# EAGLE design 8stepsV2 (EAGLE 7.4.0)
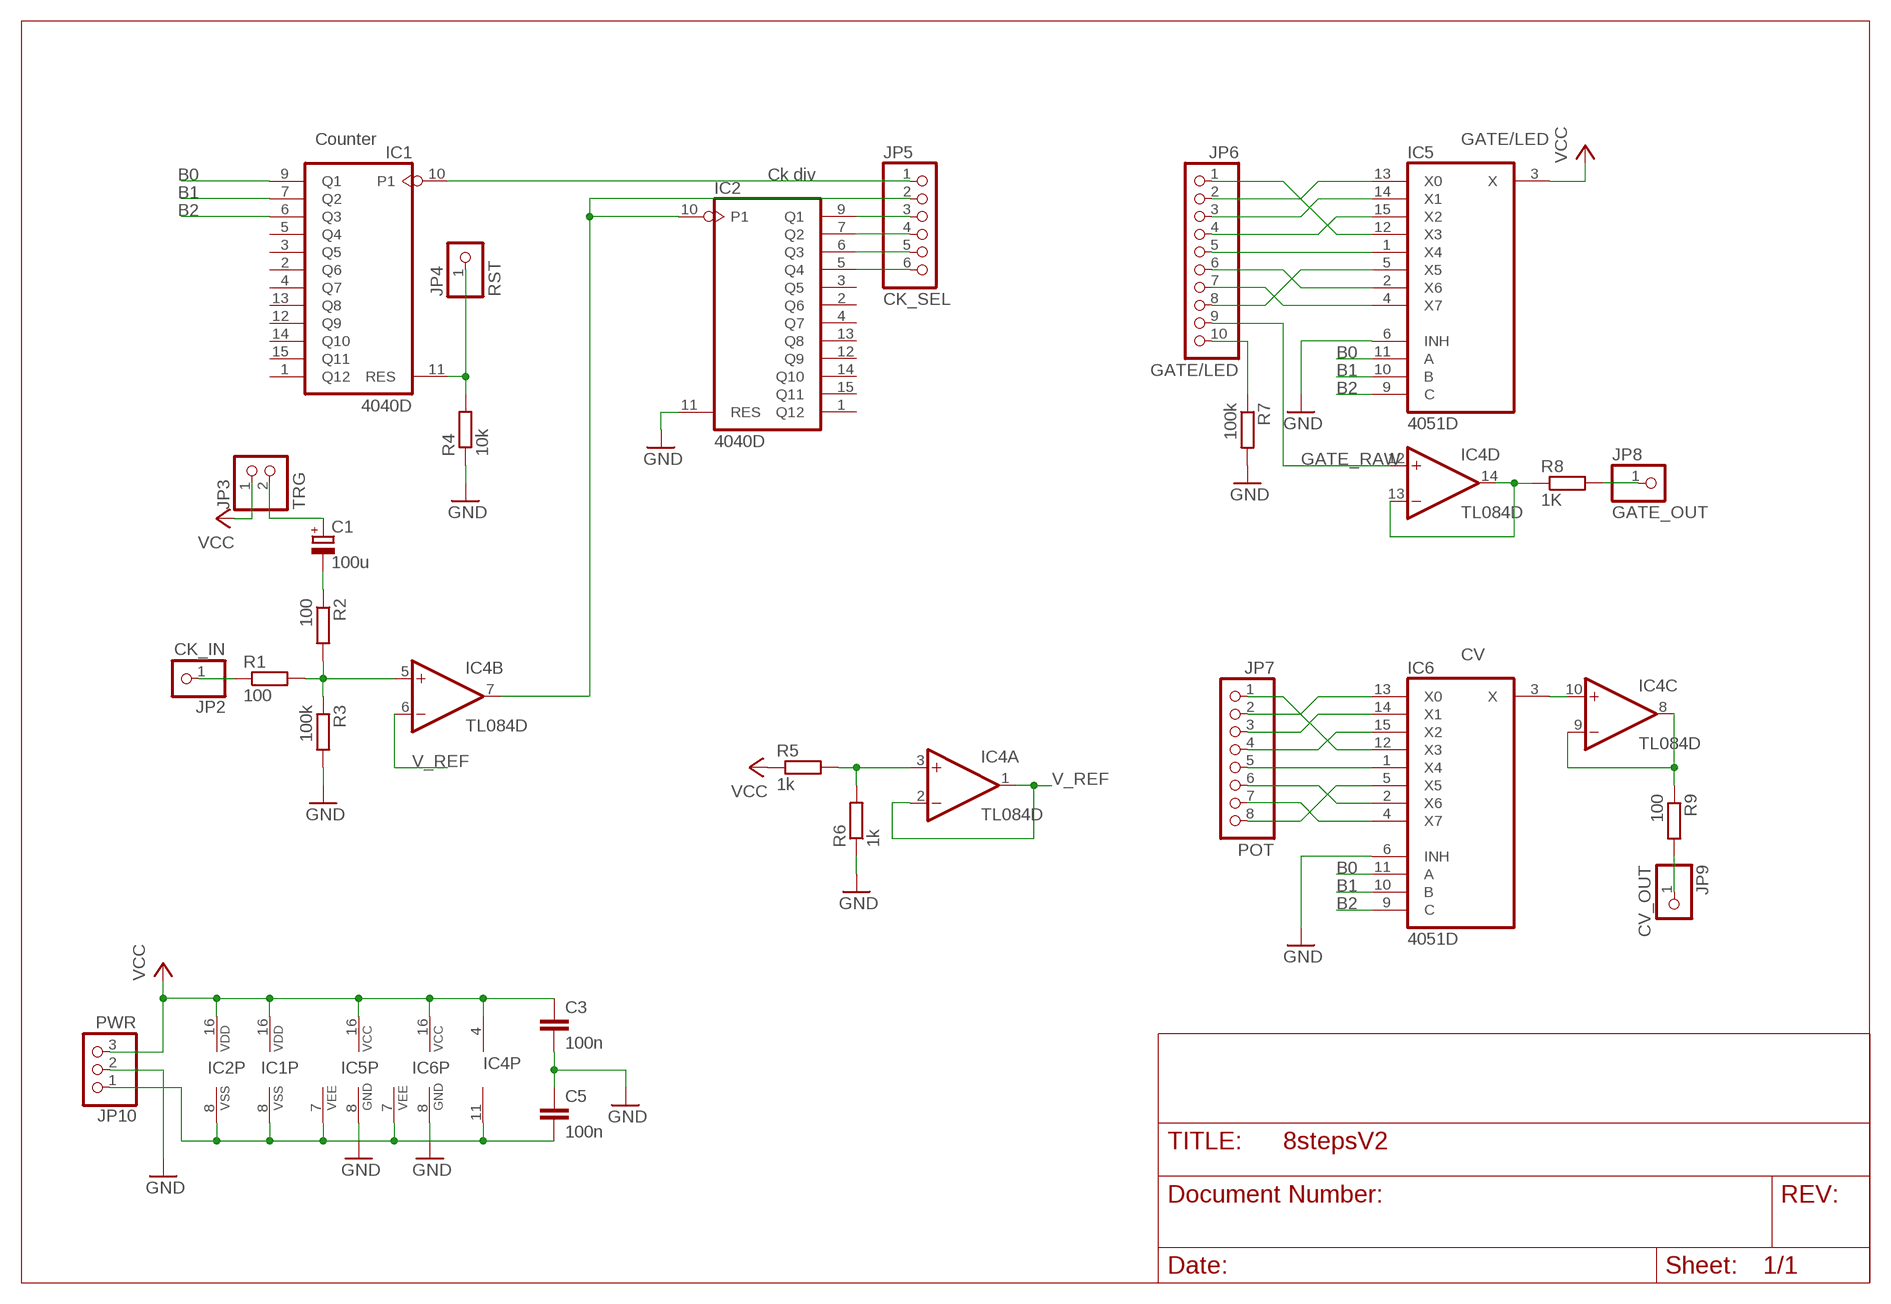
[diagram p0: schematic, sheet 1]

## Parts
C1  100u  CPOL-EUE2.5-7  [E2,5-7]
C3  100n  C-EU025-024X044  [C025-024X044]
C5  100n  C-EU025-024X044  [C025-024X044]
IC1  4040D  [SO16]
IC2  4040D  [SO16]
IC4  TL084D  [SO14]
IC5  4051D  [SO16]
IC6  4051D  [SO16]
JP2  CK_IN  PINHD-1X1  [1X01]
JP3  TRG  PINHD-1X2  [1X02]
JP4  RST  PINHD-1X1  [1X01]
JP5  CK_SEL  PINHD-1X6  [1X06]
JP6  GATE/LED  PINHD-1X10  [1X10]
JP7  POT  PINHD-1X8  [1X08]
JP8  GATE_OUT  PINHD-1X1  [1X01]
JP9  CV_OUT  PINHD-1X1  [1X01]
JP10  PWR  PINHD-1X3  [1X03]
R1  100  R-EU_R0805  [R0805]
R2  100  R-EU_R0805  [R0805]
R3  100k  R-EU_R0805  [R0805]
R4  10k  R-EU_R0805  [R0805]
R5  1k  R-EU_R0805  [R0805]
R6  1k  R-EU_R0805  [R0805]
R7  100k  R-EU_R0805  [R0805]
R8  1K  R-EU_R0805  [R0805]
R9  100  R-EU_R0805  [R0805]

## Nets
B0: IC1.9(Q1) IC5.11(A) IC6.11(A)
B1: IC1.7(Q2) IC5.10(B) IC6.10(B)
B2: IC1.6(Q3) IC5.9(C) IC6.9(C)
GATE_RAW: IC4.12(D:+IN) JP6.9
GND: C3.2 C5.1 IC2.11(RES) IC5.6(INH) IC5.8(GND) IC6.6(INH) IC6.8(GND) JP10.2 R3.2 R4.1 R6.1 R7.2
N$1: IC4.3(A:+IN) R5.2 R6.2
N$2: C1.- R2.1
N$3: IC4.10(C:+IN) IC6.3(X)
N$4: IC2.10(P1) IC4.7(B:OUT) JP5.2
N$5: IC2.9(Q1) JP5.3
N$6: IC2.7(Q2) JP5.4
N$7: IC2.6(Q3) JP5.5
N$8: IC2.5(Q4) JP5.6
N$9: IC1.10(P1) JP5.1
N$10: IC5.12(X3) JP6.1
N$11: IC5.13(X0) JP6.2
N$12: IC5.14(X1) JP6.3
N$13: IC5.15(X2) JP6.4
N$14: IC5.1(X4) JP6.5
N$15: IC5.4(X7) JP6.7
N$16: IC5.2(X6) JP6.6
N$17: IC5.5(X5) JP6.8
N$18: IC6.12(X3) JP7.1
N$19: IC6.13(X0) JP7.2
N$20: IC6.14(X1) JP7.3
N$21: IC6.15(X2) JP7.4
N$22: IC6.1(X4) JP7.5
N$23: IC6.4(X7) JP7.7
N$25: IC6.5(X5) JP7.8
N$26: IC4.8(C:OUT) IC4.9(C:-IN) R9.1
N$27: JP9.1 R9.2
N$28: JP6.10 R7.1
N$29: IC1.11(RES) JP4.1 R4.2
N$30: IC4.13(D:-IN) IC4.14(D:OUT) R8.1
N$31: JP8.1 R8.2
N$32: IC6.2(X6) JP7.6
N$33: IC4.5(B:+IN) R1.2 R2.2 R3.1
N$34: C1.+ JP3.2
N$35: JP2.1 R1.1
V_REF: IC4.1(A:OUT) IC4.2(A:-IN) IC4.6(B:-IN)
VCC: C3.1 IC1.16(VDD) IC2.16(VDD) IC4.4(P:V+) IC5.3(X) IC5.16(VCC) IC6.16(VCC) JP3.1 JP10.3 R5.1
VSS: C5.2 IC1.8(VSS) IC2.8(VSS) IC4.11(P:V-) IC5.7(VEE) IC6.7(VEE) JP10.1
Unconnected: IC1.1(Q12) IC1.2(Q6) IC1.3(Q5) IC1.4(Q7) IC1.5(Q4) IC1.12(Q9) IC1.13(Q8) IC1.14(Q10) IC1.15(Q11) IC2.1(Q12) IC2.2(Q6) IC2.3(Q5) IC2.4(Q7) IC2.12(Q9) IC2.13(Q8) IC2.14(Q10) IC2.15(Q11)

## Notes on the sheet
- Counter | GATE/LED
- Ck div
- CV

## Library data of the parts
C1 = rcl:CPOL-EU: POLARIZED CAPACITOR, European symbol
C3 C5 = rcl:C-EU: CAPACITOR, European symbol
IC1 IC2 = 40xx:4040: 12-stage binary/ripple COUNTER
IC4 = linear:TL084: OP AMP
IC5 IC6 = 40xx:4051: 8-channel ANALOG MULTIPLEXER
JP2 JP4 JP8 JP9 = pinhead:PINHD-1X1: PIN HEADER
JP3 = pinhead:PINHD-1X2: PIN HEADER
JP5 = pinhead:PINHD-1X6: PIN HEADER
JP6 = pinhead:PINHD-1X10: PIN HEADER
JP7 = pinhead:PINHD-1X8: PIN HEADER
JP10 = pinhead:PINHD-1X3: PIN HEADER
R1-R9 = rcl:R-EU_: RESISTOR, European symbol

## Net classes
0 default: clearance 0.205 mm

## Board
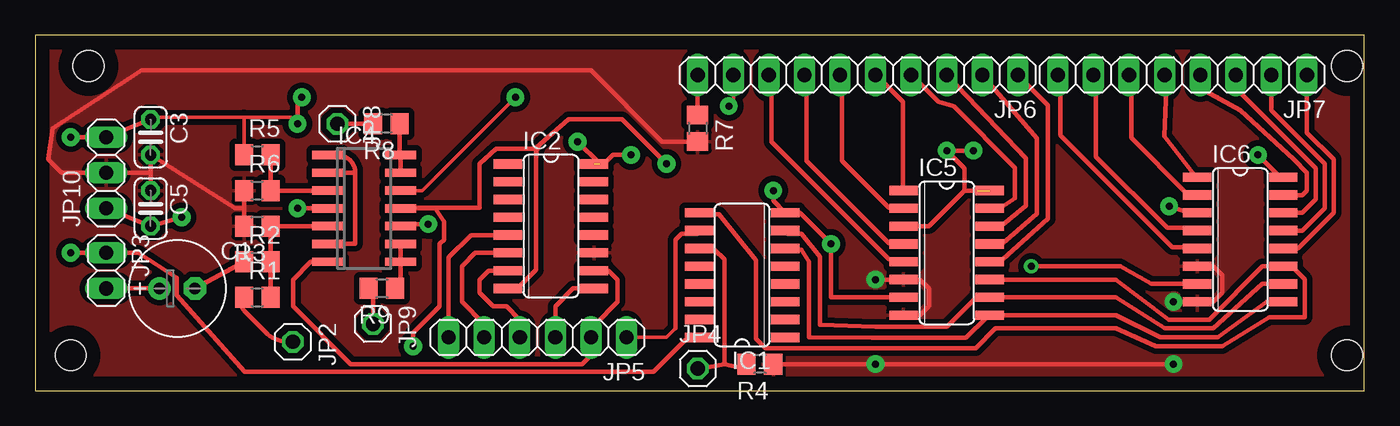
[diagram p1: board, top side]
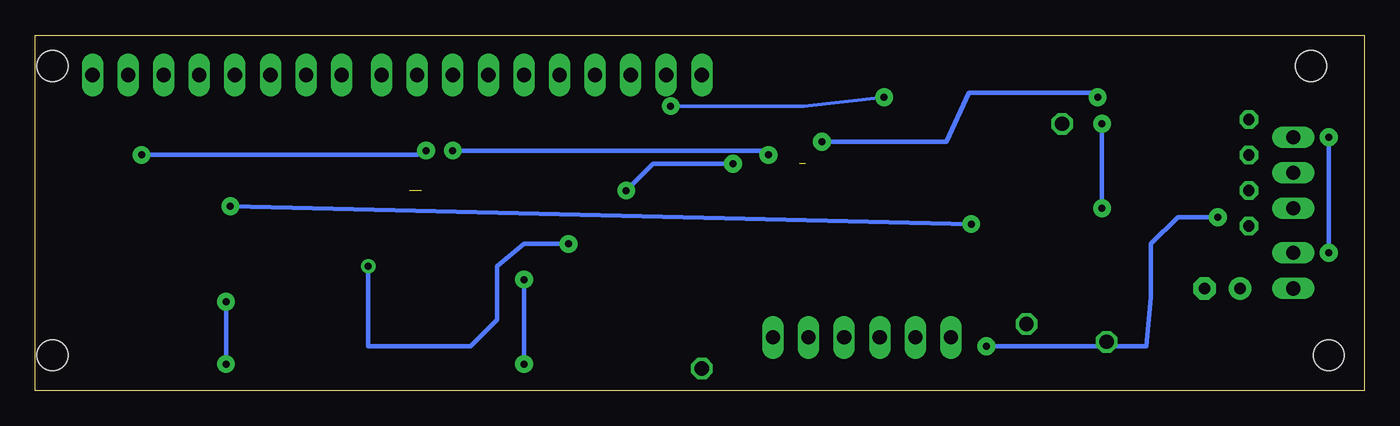
[diagram p2: board, bottom side, seen from below]

Size 94.91 x 25.39 mm. Coordinates in mm from the lower left corner, seen from the top.
Outline: 0,0 94.91,0 94.91,25.39 0,25.39 0,0
Copper layers (1*16): Top 0.035mm / dielectric 1.5mm / Bottom 0.035mm
Design rules "default": minimum track width 10mil, minimum drill 24mil, track to track 8mil, track to pad 8mil, pad to pad 8mil, via to via 8mil, smd to smd 8mil, copper to edge 40mil, drill to drill 8mil, minimum pad ring 10mil, minimum via ring 8mil, stop-mask expansion 4mil, vias tented up to drill 0mil, thermal gap 10mil
Holes 2.2 mm at 2.54,2.54 3.81,23.18 93.66,2.54 93.66,23.18

### Footprints (pad centres in the part's own frame; a part is rotated, then mirrored left to right if it is on the bottom)
E2,5-7 = drill 0.813 pad 1.6: + -1.27,0 | drill 0.813 pad 1.6 octagon: - 1.27,0
C025-024X044 = drill 0.813 octagon: 1 -1.27,0; 2 1.27,0
SO16 = smd 0.66 x 2.032: 1 -4.445,-3.073; 2 -3.175,-3.073; 3 -1.905,-3.073; 4 -0.635,-3.073; 5 0.635,-3.073; 6 1.905,-3.073; 7 3.175,-3.073; 8 4.445,-3.073; 9 4.445,3.073; 10 3.175,3.073; 11 1.905,3.073; 12 0.635,3.073; 13 -0.635,3.073; 14 -1.905,3.073; 15 -3.175,3.073; 16 -4.445,3.073
SO14 = smd 0.6 x 2.2: 1 -3.81,-2.6; 2 -2.54,-2.6; 3 -1.27,-2.6; 4 0,-2.6; 5 1.27,-2.6; 6 2.54,-2.6; 7 3.81,-2.6; 8 3.81,2.6; 9 2.54,2.6; 10 1.27,2.6; 11 0,2.6; 12 -1.27,2.6; 13 -2.54,2.6; 14 -3.81,2.6
1X01 = drill 1.016 octagon: 1 0,0
1X02 = drill 1.016 long: 1 -1.27,0; 2 1.27,0
1X06 = drill 1.016 long: 1 -6.35,0; 2 -3.81,0; 3 -1.27,0; 4 1.27,0; 5 3.81,0; 6 6.35,0
1X10 = drill 1.016 long: 1 -11.43,0; 2 -8.89,0; 3 -6.35,0; 4 -3.81,0; 5 -1.27,0; 6 1.27,0; 7 3.81,0; 8 6.35,0; 9 8.89,0; 10 11.43,0
1X08 = drill 1.016 long: 1 -8.89,0; 2 -6.35,0; 3 -3.81,0; 4 -1.27,0; 5 1.27,0; 6 3.81,0; 7 6.35,0; 8 8.89,0
1X03 = drill 1.016 long: 1 -2.54,0; 2 0,0; 3 2.54,0
R0805 = smd 1.3 x 1.5: 1 -0.95,0; 2 0.95,0

### Placement (x,y rotation side)
C1  10.16,7.3 0 top
C3  8.26,18.1 270 top
C5  8.26,13.02 270 top
IC1  50.48,8.26 90 top
IC2  36.83,11.75 270 top
IC4  23.5,13.02 270 top
IC5  65.09,9.84 270 top
IC6  86.04,10.79 270 top
JP2  18.41,3.49 270 top
JP3  5.08,8.57 270 top
JP4  47.31,1.59 0 top
JP5  35.88,3.81 180 top
JP6  58.74,22.54 180 top
JP7  81.92,22.54 180 top
JP8  21.59,19.05 270 top
JP9  24.13,4.76 270 top
JP10  5.08,15.56 90 top
R1  15.88,6.67 0 top
R2  15.88,9.21 0 top
R3  15.88,11.75 180 top
R4  51.75,1.91 180 top
R5  15.88,16.83 0 top
R6  15.88,14.29 0 top
R7  47.31,18.73 270 top
R8  25.08,19.05 180 top
R9  24.77,7.3 180 top

### Tracks (layer width: path | path; a pad name or v marks a point on that pad's centre or on a via)
B0
  Top 0.305: IC5.11 77.15,7.94 80.96,5.08 83.82,5.08 87.63,8.89 IC6.11 89.28,8.86 89.74,8.86 90.66,7.94 90.66,5.24 88.11,5.24 84.77,3.17 84.77,3.16 80.1,3.16 80.01,3.17 77.15,4.45 68.58,4.45 67.17,3.04 52.16,3.04 51.47,3.73 51.47,9.32 48.84,12.59 47.51,12.59 IC1.9
B1
  Top 0.305: IC6.10 87.63,7.62 84.14,4.45 80.64,4.45 77.15,6.67 IC5.10 67.94,6.62 67.16,6.62 65.1,4.56 59.99,4.56 56.04,4.7 56.04,9.57 54.72,11.21 53.71,11.21 IC1.7
B2
  Top 0.305: IC6.9 87.95,6.35 84.45,3.81 80.33,3.81 77.15,5.4 IC5.9 67.94,5.24 66.47,3.78 59.77,3.78 55.27,3.83 55.27,9.2 54.72,10.06 53.71,10.06 IC1.6
GATE_RAW  (via drill 0.5 pad 1.27)
  Top 0.254: JP6.9 49.85,20.64 v49.53,20.32 | v34.29,20.95 27.62,14.29 IC4.12
  Bottom 0.254: v49.53,20.32 40.01,20.32 v34.29,20.95
GND  (via drill 0.5 pad 1.27)
  Top 0.305: 14.93,13.02 R3.2 14.93,13.02 14.92,13.02 | 14.93,13.02 R6.1 | IC6.6 84.14,8.89 84.77,8.26 84.77,6.99 84.14,6.35 IC6.8 v81.28,6.35 | 8.26,15.56 JP10.2 1.91,15.56 0.95,16.51 1.27,18.73 7.62,22.86 39.69,22.86 44.77,17.78 R7.2 | 8.26,15.56 C5.1 | 14.92,13.02 14.93,13.02 | IC5.8 63.18,5.4 63.82,6.03 63.82,7.3 63.18,7.94 IC5.6 v60.01,7.94 | v81.28,1.91 v60.01,1.91 R4.1 | 14.92,13.02 14.29,13.02 C3.2 8.26,15.56
  Bottom 0.305: v81.28,6.35 v81.28,1.91 | v60.01,7.94 v60.01,1.91
  pour Top (isolate 0.406): -0.64,26.35 96.52,26.35 96.52,-2.54 -0.64,-2.54
N$1
  Top 0.305: IC4.3 R6.2 R5.2
N$2
  Top 0.305: C1.- R2.1
N$3  (via drill 0.5 pad 1.27)
  Top 0.305: v80.97,13.17 82.86,12.53 IC6.3 | v28.07,11.9 26.24,11.9 IC4.10
  Bottom 0.305: v28.07,11.9 v80.97,13.17
N$4
  Top 0.305: IC2.10 40.96,8.57 41.59,7.94 41.59,6.35 40.01,4.76 40.01,4.13 JP5.2 40.01,3.49 40.01,2.86 39.05,1.91 22.54,1.91 18.41,6.03 18.41,7.94 19.68,9.21 IC4.7
N$5
  Top 0.305: JP5.3 37.15,6.03 38.42,7.3 IC2.9
N$6
  Top 0.305: IC2.7 32.38,8.57 31.75,7.94 31.75,6.99 32.7,6.03 33.66,6.03 34.61,5.08 JP5.4
N$7
  Top 0.305: JP5.5 32.07,4.76 30.48,6.35 30.48,8.89 31.43,9.84 IC2.6
N$8
  Top 0.305: IC2.5 31.11,11.11 29.53,9.53 JP5.6
N$9
  Top 0.254: 45.72,4.45 45.09,3.81 JP5.1
  Top 0.305: 45.72,4.45 45.72,10.79 46.14,11.21 47.28,11.21 IC1.10
N$10
  Top 0.305: IC5.12 68.17,9.38 69.09,9.38 72.3,12.27 72.3,20.39 70.23,22.46 JP6.1
N$11
  Top 0.305: IC5.13 68.17,10.52 69.09,10.52 71.52,12.64 71.52,18.01 67.71,22.46 JP6.2
N$12
  Top 0.305: IC5.14 68.17,11.9 69.14,11.9 70.75,13.19 70.75,16.58 65.19,22.46 JP6.3
N$13
  Top 0.305: IC5.15 68.17,13.05 68.96,13.05 69.97,13.74 69.97,15.92 65.59,20.3 64.5,20.62 62.66,22.46 JP6.4
N$14
  Top 0.305: IC5.1 61.97,14.42 61.97,20.62 60.14,22.46 JP6.5
N$15
  Top 0.305: IC5.4 61.97,10.52 60.97,10.52 55.09,16.4 55.09,22.46 JP6.7
N$16
  Top 0.305: IC5.2 61.97,13.05 60.97,13.05 57.61,16.4 57.61,22.46 JP6.6
N$17
  Top 0.305: IC5.5 61.97,9.38 60.97,9.38 52.56,17.78 52.56,22.46 JP6.8
N$18
  Top 0.305: JP7.1 90.81,18.41 92.71,16.51 92.71,12.7 90.17,10.16 IC6.12
N$19
  Top 0.305: JP7.2 88.27,20 92.08,16.19 92.08,13.02 90.49,11.43 IC6.13
N$20
  Top 0.305: JP7.3 85.72,21.59 91.44,15.88 91.44,13.65 90.49,12.7 IC6.14
N$21
  Top 0.305: JP7.4 83.19,21.59 86.04,20 89.85,16.51 90.81,15.56 90.81,14.29 90.49,13.97 IC6.15
N$22
  Top 0.305: IC6.1 82.86,15.29 80.63,18.17 80.79,22.46 JP7.5
N$23
  Top 0.305: IC6.4 82.86,11.62 80.83,11.62 75.74,16.7 75.74,22.46 JP7.7
N$25
  Top 0.305: IC6.5 82.86,10.24 81.2,10.24 73.22,18.22 73.22,22.46 JP7.8
N$26
  Top 0.305: IC4.9 IC4.8 26.09,7.68 R9.1
N$27
  Top 0.305: JP9.1 24.13,6.99 R9.2
N$28
  Top 0.305: R7.1 47.28,19.7 47.28,22.46 JP6.10
N$29
  Top 0.305: 49.21,1.89 47.51,1.57 JP4.1 | 49.21,1.89 50.73,1.57 R4.2 | 49.21,1.89 49.21,9.38 48.52,10.06 47.51,10.06 IC1.11
N$30
  Top 0.305: R8.1 26.03,16.89 IC4.14 IC4.13
N$31
  Top 0.305: JP8.1 R8.2
N$32
  Top 0.305: IC6.2 82.86,14.14 82.17,14.14 78.27,18.04 78.27,22.46 JP7.6
N$33
  Top 0.305: IC4.5 R3.1 R2.2 R1.2
N$34
  Top 0.305: C1.+ JP3.2
N$35
  Top 0.305: JP2.1 18.09,3.49 arc-45 16.47,4.16 15.02,5.62 arc-45 14.61,6.62 | 14.61,6.62 | 14.61,6.62 14.61,6.67 | R1.1 14.76,6.62 14.61,6.62
V_REF
  Top 0.305: IC4.6 22.86,10.48 22.86,15.56 | IC4.1 21.59,16.83 arc-90 22.86,15.56 | 22.86,15.56 IC4.2
VCC  (via drill 0.5 pad 1.27)  (2 unrouted)
  Top 0.254: 8.43,19.53 14.92,19.53 | 14.92,19.53 18.25,19.53 v18.73,19.05 | R5.1 14.93,19.52 14.92,19.53
  Top 0.305: IC1.16 47.28,3.64 46.44,3.64 44.14,1.34 14.96,1.34 10.12,6.82 10.12,8.05 7.38,9.83 5.28,9.83 JP3.1 v2.54,9.84 | 8.43,19.53 C3.1 JP10.3 v2.54,18.1 | IC6.16 88.9,15.24 v87.31,16.83 | 66.36,14.29 67.31,14.29 | IC5.3 63.82,11.75 66.36,14.29 | 66.36,14.29 66.36,15.88 v65.09,17.14 v66.99,17.14 | v42.55,16.83 41.27,16.83 40.64,16.19 40.32,16.19 v38.73,17.78 | IC4.4 v18.73,13.02 | v18.73,19.05 18.73,20.64 v19.05,20.95
  Bottom 0.305: v87.31,16.83 67.63,16.83 v66.99,17.14 | v65.09,17.14 42.86,17.14 v42.55,16.83 | v38.73,17.78 29.84,17.78 28.26,21.27 19.37,21.27 v19.05,20.95 | v18.73,13.02 v18.73,19.05 | v2.54,18.1 v2.54,9.84
VSS  (via drill 0.5 pad 1.02, 0.5 pad 1.27)
  Top 0.305: JP10.1 C5.2 v10.48,12.38 | 35.76,16.72 35.76,8.63 34.43,7.31 33.97,7.31 IC2.8 | 35.76,16.72 35.84,17.27 32.93,17.27 31.75,16.19 31.75,13.05 26.24,13.05 IC4.11 28.57,13.02 29.21,12.06 29.21,10.79 28.89,10.48 28.89,6.03 26.99,4.13 v26.99,3.17 | 35.76,16.72 35.76,17.34 38.1,19.37 41.91,19.37 v45.09,16.19 | v52.7,14.29 52.7,13.55 IC1.8 54.61,12.7 v56.83,10.48 56.83,6.67 IC5.7 | IC6.7 79.69,7.62 77.47,8.89 v71.12,8.89
  Bottom 0.305: v26.99,3.17 15.56,3.17 15.24,6.67 15.24,10.48 13.34,12.38 v10.48,12.38 | v45.09,16.19 50.8,16.19 v52.7,14.29 | v71.12,8.89 71.12,3.17 63.82,3.17 61.91,5.08 61.91,8.89 60.01,10.48 v56.83,10.48

### Text on the board
Document: 8 STEPS SEQUENCER | gAZ '22